# Altium schematic sheet block_diagram.SchDoc
size A4
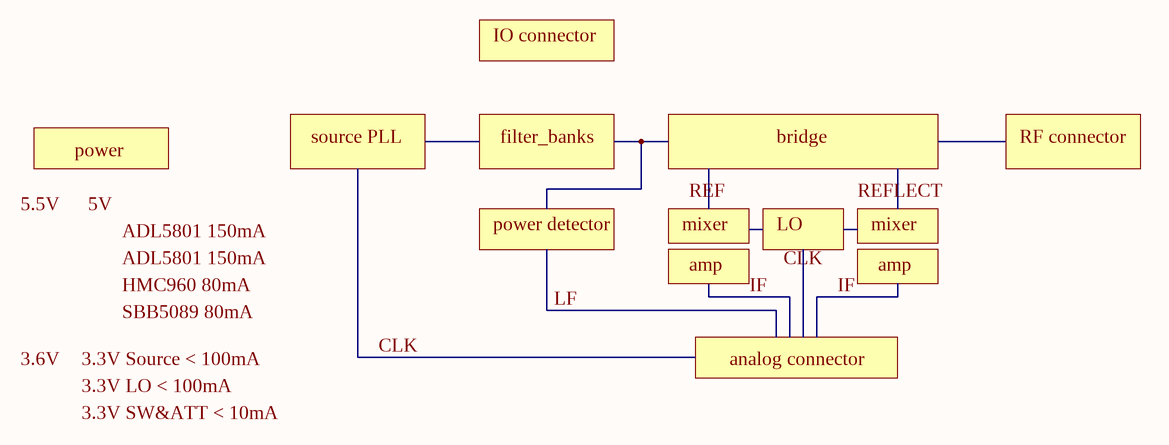
[diagram p0: block_diagram.SchDoc]

## Notes on the sheet
- IO connector
- power
- source PLL
- filter_banks
- bridge
- RF connector
- 5.5V
- 5V
- ADL5801 150mA
- power detector
- mixer
- REF
- LO
- CLK
- REFLECT
- HMC960 80mA
- SBB5089 80mA
- LF
- amp
- IF
- 3.6V
- 3.3V Source < 100mA
- 3.3V LO < 100mA
- analog connector
- 3.3V SW&ATT < 10mA